# EAGLE schematic pcb - vcf et etage sortie v2 (EAGLE 9.3.1)
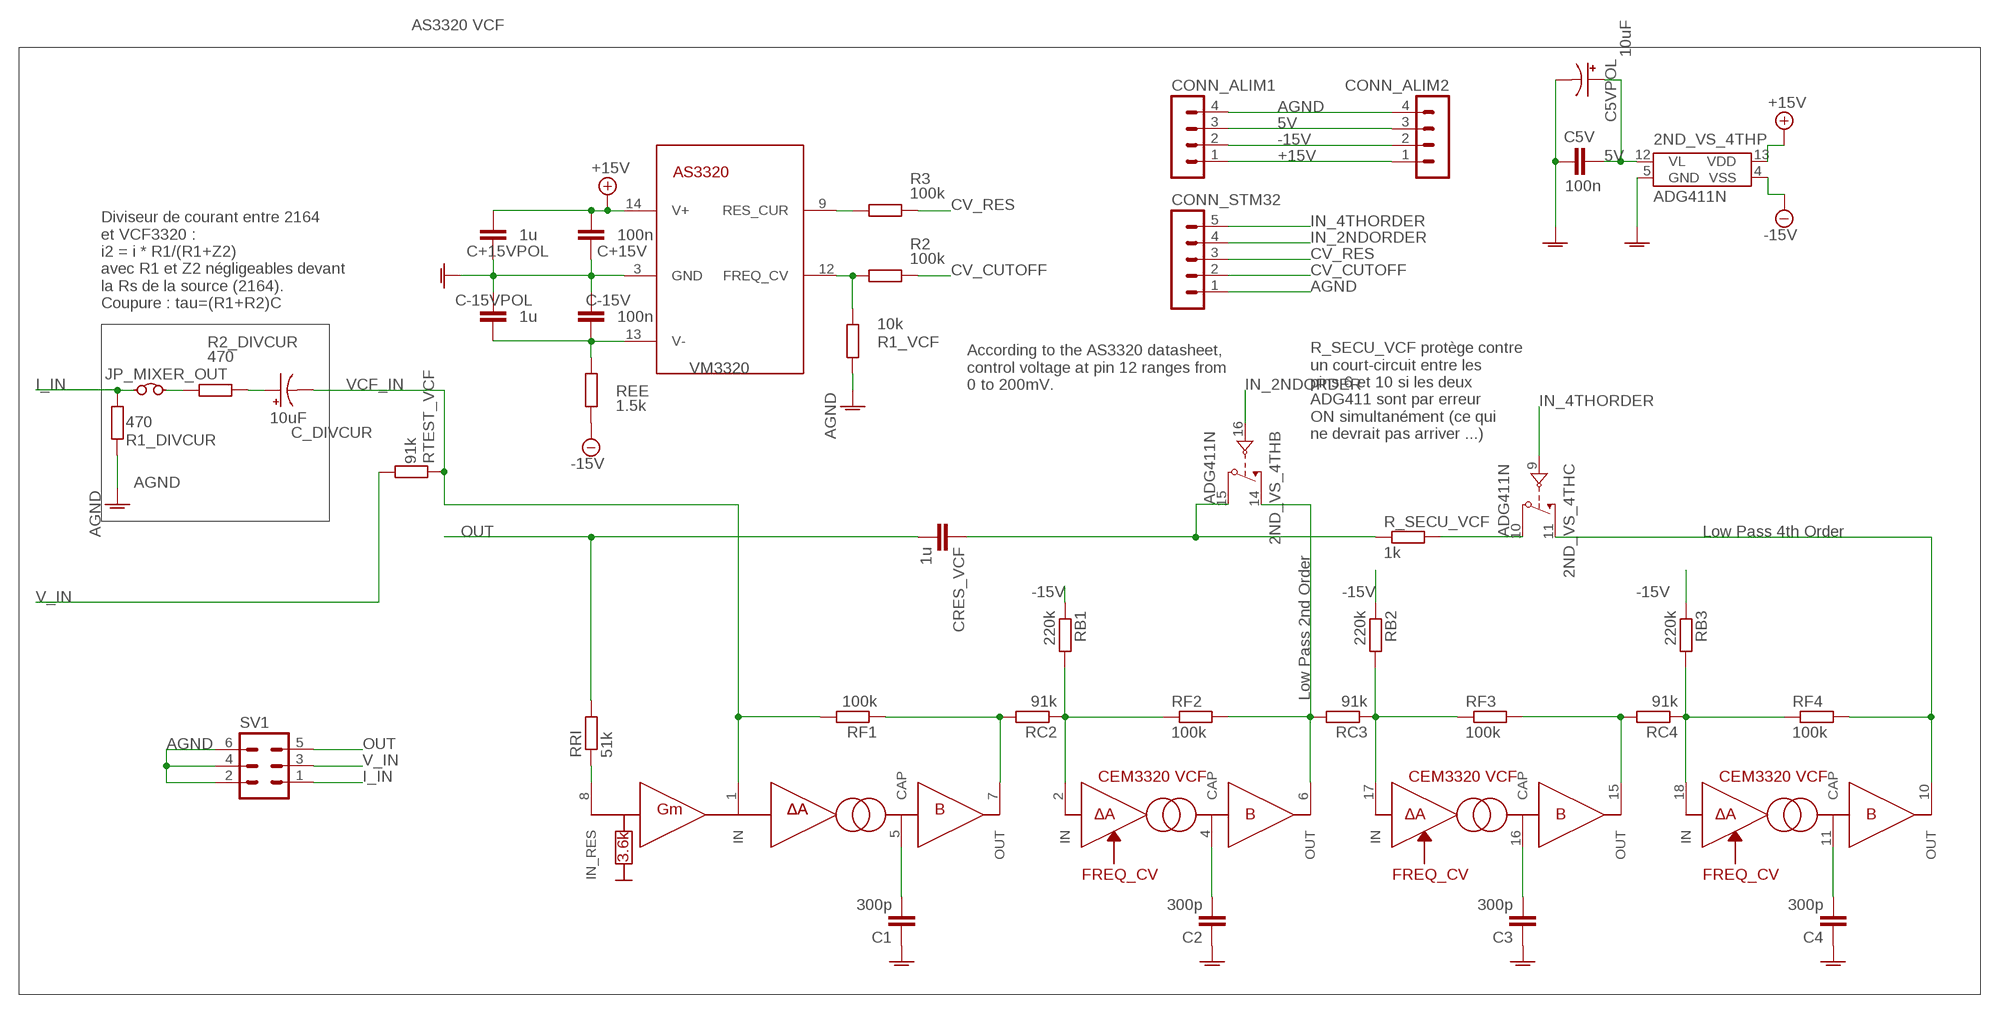
[diagram p0: schematic, sheet 1]

## Parts
2ND_VS_4TH  ADG411N  [DIL16]
C1  300p  C-EU050-024X044  [C050-024X044]
C2  300p  C-EU050-024X044  [C050-024X044]
C3  300p  C-EU075-032X103  [C075-032X103]
C4  300p  C-EU075-032X103  [C075-032X103]
C5V  100n  C-EU050-024X044  [C050-024X044]
C5VPOL  10uF  10UF-POLAR-RADIAL-2.5MM-KIT-25V-20%  [CPOL-RADIAL-2.5MM-5MM-KIT]
C+15V  100n  C-EU050-024X044  [C050-024X044]
C+15VPOL  1u  C-EU050-024X044  [C050-024X044]
C-15V  100n  C-EU050-025X075  [C050-025X075]
C-15VPOL  1u  C-EU075-032X103  [C075-032X103]
C_DIVCUR  10uF  10UF-POLAR-RADIAL-2.5MM-KIT-25V-20%  [CPOL-RADIAL-2.5MM-5MM-KIT]
CONN_ALIM1  MA04-1  [MA04-1]
CONN_ALIM2  MA04-1  [MA04-1]
CONN_STM32  MA05-1  [MA05-1]
CRES_VCF  1u  C-EU075-032X103  [C075-032X103]
JP_MIXER_OUT  JUMPER_WIRE  [JUMPER]
R1_DIVCUR  470  R-EU_0207/10  [0207/10]
R1_VCF  10k  R-EU_0204/7  [0204/7]
R2  100k  R-EU_0204/5  [0204/5]
R2_DIVCUR  470  R-EU_0207/10  [0207/10]
R3  100k  R-EU_0204/7  [0204/7]
R_SECU_VCF  1k  R-EU_0204/7  [0204/7]
RB1  220k  R-EU_0207/10  [0207/10]
RB2  220k  R-EU_0204/7  [0204/7]
RB3  220k  R-EU_0204/5  [0204/5]
RC2  91k  R-EU_0204/7  [0204/7]
RC3  91k  R-EU_0204/5  [0204/5]
RC4  91k  R-EU_0204/7  [0204/7]
REE  1.5k  R-EU_0207/10  [0207/10]
RF1  100k  R-EU_0207/10  [0207/10]
RF2  100k  R-EU_0204/5  [0204/5]
RF3  100k  R-EU_0207/10  [0207/10]
RF4  100k  R-EU_0204/7  [0204/7]
RRI  51k  R-EU_0207/10  [0207/10]
RTEST_VCF  91k  R-EU_0204/5  [0204/5]
SV1  MA03-2  [MA03-2]
VCF  AS3320  [DIL18]

## Nets
5V: 2ND_VS_4TH.12(P:VL) C5V.1 C5VPOL.1(+) CONN_ALIM1.3 CONN_ALIM2.3
+15V: 2ND_VS_4TH.13(P:VDD) C+15V.2 C+15VPOL.2 CONN_ALIM1.1 CONN_ALIM2.1 VCF.14(POW$1:V+)
-15V: 2ND_VS_4TH.4(P:VSS) CONN_ALIM1.2 CONN_ALIM2.2 RB1.1 RB2.1 RB3.1 REE.1
AGND: 2ND_VS_4TH.5(P:GND) C1.1 C2.1 C3.1 C4.1 C5V.2 C5VPOL.2(-) C+15V.1 C+15VPOL.1 C-15V.2 C-15VPOL.2 CONN_ALIM1.4 CONN_ALIM2.4 CONN_STM32.1 R1_DIVCUR.2 R1_VCF.2 SV1.2 SV1.4 SV1.6 VCF.3(POW$1:GND)
CV_CUTOFF: CONN_STM32.2 R2.2
CV_RES: CONN_STM32.3 R3.2
I_IN: JP_MIXER_OUT.1 R1_DIVCUR.1 SV1.1
IN_2NDORDER: 2ND_VS_4TH.16(B:IN) CONN_STM32.4
IN_4THORDER: 2ND_VS_4TH.9(C:IN) CONN_STM32.5
N$5: C1.2 VCF.5(OTA$1:CAP)
N$17: C3.2 VCF.16(OTA$4:CAP)
N$18: C2.2 VCF.4(OTA$2:CAP)
N$24: C4.2 VCF.11(OTA$3:CAP)
N$37: R1_VCF.1 R2.1 VCF.12(POW$1:FREQ_CV)
N$57: RC2.2 RF1.1 VCF.7(OTA$1:OUT)
N$58: 2ND_VS_4TH.15(B:D) CRES_VCF.1 R_SECU_VCF.1
N$62: RB1.2 RC2.1 RF2.1 VCF.2(OTA$2:IN)
N$65: 2ND_VS_4TH.14(B:S) RC3.2 RF2.2 VCF.6(OTA$2:OUT)
N$69: 2ND_VS_4TH.11(C:S) RF4.2 VCF.10(OTA$3:OUT)
N$72: RB2.2 RC3.1 RF3.1 VCF.17(OTA$4:IN)
N$73: 2ND_VS_4TH.10(C:D) R_SECU_VCF.2
N$75: C_DIVCUR.1(+) R2_DIVCUR.1
N$79: JP_MIXER_OUT.2 R2_DIVCUR.2
N$82: RC4.2 RF3.2 VCF.15(OTA$4:OUT)
N$83: RB3.2 RC4.1 RF4.1 VCF.18(OTA$3:IN)
N$86: RRI.1 VCF.8(OTA$1:IN_RES)
N$87: R3.1 VCF.9(POW$1:RES_CUR)
OUT: CRES_VCF.2 RRI.2 SV1.5
V_IN: RTEST_VCF.1 SV1.3
VCF_IN: C_DIVCUR.2(-) RF1.2 RTEST_VCF.2 VCF.1(OTA$1:IN)
VM3320: C-15V.1 C-15VPOL.1 REE.2 VCF.13(POW$1:V-)
Unconnected: 2ND_VS_4TH.1(A:IN) 2ND_VS_4TH.2(A:D) 2ND_VS_4TH.3(A:S) 2ND_VS_4TH.6(D:S) 2ND_VS_4TH.7(D:D) 2ND_VS_4TH.8(D:IN)

## Notes on the sheet
- AS3320 VCF
- Diviseur de courant entre 2164 
  et VCF3320 : 
  i2 = i * R1/(R1+Z2)
  avec R1 et Z2 négligeables devant
  la Rs de la source (2164).
  Coupure : tau=(R1+R2)C
- According to the AS3320 datasheet, 
  control voltage at pin 12 ranges from
  0 to 200mV.
- R_SECU_VCF protège contre 
  un court-circuit entre les 
  pins 6 et 10 si les deux 
  ADG411 sont par erreur 
  ON simultanément (ce qui 
  ne devrait pas arriver ...)
- Low Pass 4th Order
- Low Pass 2nd Order

## Library data of the parts
2ND_VS_4TH = analog-devices:ADG411: LC2MOS Precision Quad SPST Switches Source: http://www.analog.com/static/imported-files/data_sheets/ADG411_412_413.pdf; MF: ALTERA CORPORATION; MPN: ADG411BN; OC_FARNELL: 1424317; OC_NEWARK: 05F6198
C1-C4 C5V C+15V C+15VPOL C-15V C-15VPOL CRES_VCF = rcl:C-EU: CAPACITOR, European symbol; SPICEPREFIX: C
C5VPOL C_DIVCUR = SparkFun-Capacitors:10UF-POLAR: 10.0µF polarized capacitors A capacitor is a passive two-terminal electrical component used to store electrical energy temporarily in an electric field.; PROD_ID: CAP-08440
CONN_ALIM1 CONN_ALIM2 = con-lstb:MA04-1: PIN HEADER; OC_FARNELL: unknown; OC_NEWARK: unknown
CONN_STM32 = con-lstb:MA05-1: PIN HEADER; OC_FARNELL: unknown; OC_NEWARK: unknown
JP_MIXER_OUT = 6P1_EVB:JUMPER: Wire jumper .1" C
R1_DIVCUR R1_VCF R2 R2_DIVCUR R3 R_SECU_VCF RB1-RB3 RC2-RC4 REE RF1-RF4 RRI RTEST_VCF = rcl:R-EU_: RESISTOR, European symbol; SPICEPREFIX: R
SV1 = con-lstb:MA03-2: PIN HEADER; OC_FARNELL: unknown; OC_NEWARK: unknown
VCF = analog-audio-chips:AS3320: Voltage Controlled Filter capable of 4th order LP, BP or HP designed by famous audio chips designer Curtis Electronics.